# Altium schematic sheet esp32-pico-d4.SchDoc
size A4
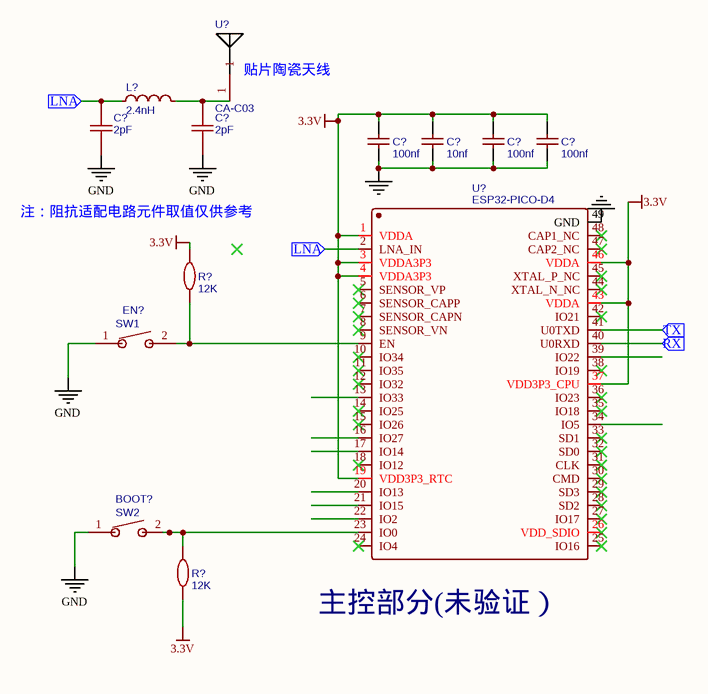
[diagram p0: esp32-pico-d4.SchDoc]

## Parts
(Parts that share a designator on the sheet are numbered #1, #2 ... from top to bottom, then left to right.)
BOOT?  SW2  [SW-SMD_L4.0-W2.9-P4.15-EH]
C?#1  2pF  [C0402]
C?#2  2pF  [C0402]
C?#3  100nf  [C0402]
C?#4  10nf  [C0402]
C?#5  100nf  [C0402]
C?#6  100nf  [C0402]
EN?  SW1  [SW-SMD_L4.0-W2.9-P4.15-EH]
L?  2.4nH  [C0402]
R?#1  12K  [R0402]
R?#2  12K  [R0402]
U?#1  CA-C03  [ANT2051]
U?#2  ESP32-PICO-D4  [QFN-48_L7.0-W7.0-P0.50-BL-EP5.4]

## Ports
LNA (in), RX (in), TX (in)

## Nets
3.3V: C?#3.2 C?#4.2 C?#5.2 C?#6.2 R?#1.2 R?#2.1 U?#2.1(VDDA) U?#2.3(VDDA3P3) U?#2.4(VDDA3P3) U?#2.19(VDD3P3_RTC) U?#2.37(VDD3P3_CPU) U?#2.43(VDDA) U?#2.46(VDDA)
GND: BOOT?.1 C?#1.1 C?#2.1 C?#3.1 C?#4.1 C?#5.1 C?#6.1 EN?.1 U?#2.49(GND)
LNA: C?#1.2 L?.1 U?#2.2(LNA_IN) ; port LNA
RX: U?#2.40(U0RXD) ; port RX
TX: U?#2.41(U0TXD) ; port TX
NetBOOT?_2: BOOT?.2 R?#2.2 U?#2.23(IO0)
NetC?#2_2: C?#2.2 L?.2 U?#1.1
NetEN?_2: EN?.2 R?#1.1 U?#2.9(EN)

Not connected (* = marked no-connect by the designer): U?#2 5(SENSOR_VP)* 6(SENSOR_CAPP)* 7(SENSOR_CAPN)* 8(SENSOR_VN)* 10(IO34)* 11(IO35)* 12(IO32)* 13(IO33) 14(IO25)* 15(IO26)* 16(IO27) 17(IO14) 18(IO12)* 20(IO13) 21(IO15) 22(IO2) 24(IO4)* 25(IO16)* 26(VDD_SDIO)* 27(IO17)* 28(SD2)* 29(SD3)* 30(CMD)* 31(CLK)* 32(SD0)* 33(SD1)* 34(IO5) 35(IO18)* 36(IO23)* 38(IO19)* 39(IO22) 42(IO21)* 44(XTAL_N_NC)* 45(XTAL_P_NC)* 47(CAP2_NC)* 48(CAP1_NC)*

## Notes on the sheet
- 注：阻抗适配电路元件取值仅供参考
- (near U?#2) 主控部分(未验证）
- (in symbol CA-C03) 贴片陶瓷天线

## Library data of the parts
BOOT? = SW2: BOM_Manufacturer: BRIGHT; BOM_Manufacturer Part: TSA343G00D-250J2; Contributor: LCSC; BOM_Supplier: LCSC; BOM_Supplier Part: C354947; BOM_JLCPCB Part Class: Extended Part; spicePre: S; spiceSymbolName: TSA343G00D-250J2
C?#1 C?#2 = 2pF: nameAlias: Value(F); Contributor: LCEDA_Lib; spicePre: C; spiceSymbolName: C_0402_US
C?#3 C?#5 C?#6 = 10uF: BOM_Manufacturer Part: CL05A106MQ5NUNC; BOM_Manufacturer: SAMSUNG; nameAlias: Capacitance; BOM_Supplier: LCSC; BOM_Supplier Part: C15525; BOM_JLCPCB Part Class: Basic Part; spicePre: C; spiceSymbolName: CL05A106MQ5NUNC
C?#4 = 10uF: BOM_Manufacturer Part: CL05A106MQ5NUNC; BOM_Manufacturer: SAMSUNG; nameAlias: Capacitance; Package Display: No; BOM_Supplier: LCSC; BOM_Supplier Part: C15525; BOM_JLCPCB Part Class: Basic Part; spicePre: C; spiceSymbolName: CL05A106MQ5NUNC
EN? = SW1: BOM_Manufacturer: BRIGHT; BOM_Manufacturer Part: TSA343G00D-250J2; Contributor: LCSC; BOM_Supplier: LCSC; BOM_Supplier Part: C354947; BOM_JLCPCB Part Class: Extended Part; spicePre: S; spiceSymbolName: TSA343G00D-250J2
L? = 2.4nH: nameAlias: Value(H); Contributor: LCEDA_Lib; spicePre: L; spiceSymbolName: L0402_US
R?#1 R?#2 = 12K: BOM_Manufacturer: YAGEO; BOM_Manufacturer Part: AC0402JR-0712KL; nameAlias: Resistance (Ohms); Contributor: LCSC; Resistance: 12kΩ; BOM_Supplier: LCSC; BOM_Supplier Part: C227297; BOM_JLCPCB Part Class: Extended Part; spicePre: R; spiceSymbolName: AC0402JR-0712KL
U?#1 = CA-C03: Contributor: BVREAVE; link: https://item.taobao.com/item.htm?spm=a230r.1.14.4.81c453c0MSMjjx&id=627328734225&ns=1&abbucket=1#detail; spicePre: U; spiceSymbolName: ANT_CrossAir_CA-C03
U?#2 = ESP32-PICO-D4: BOM_Manufacturer: Espressif Systems; Contributor: LCSC; Package Display: No; BOM_Supplier: LCSC; BOM_Supplier Part: C193707; BOM_Manufacturer Part: ESP32-PICO-D4; BOM_JLCPCB Part Class: Extended Part; spicePre: U; spiceSymbolName: ESP32-PICO-D4